# EAGLE design RFPIGW (EAGLE 6.5.0)
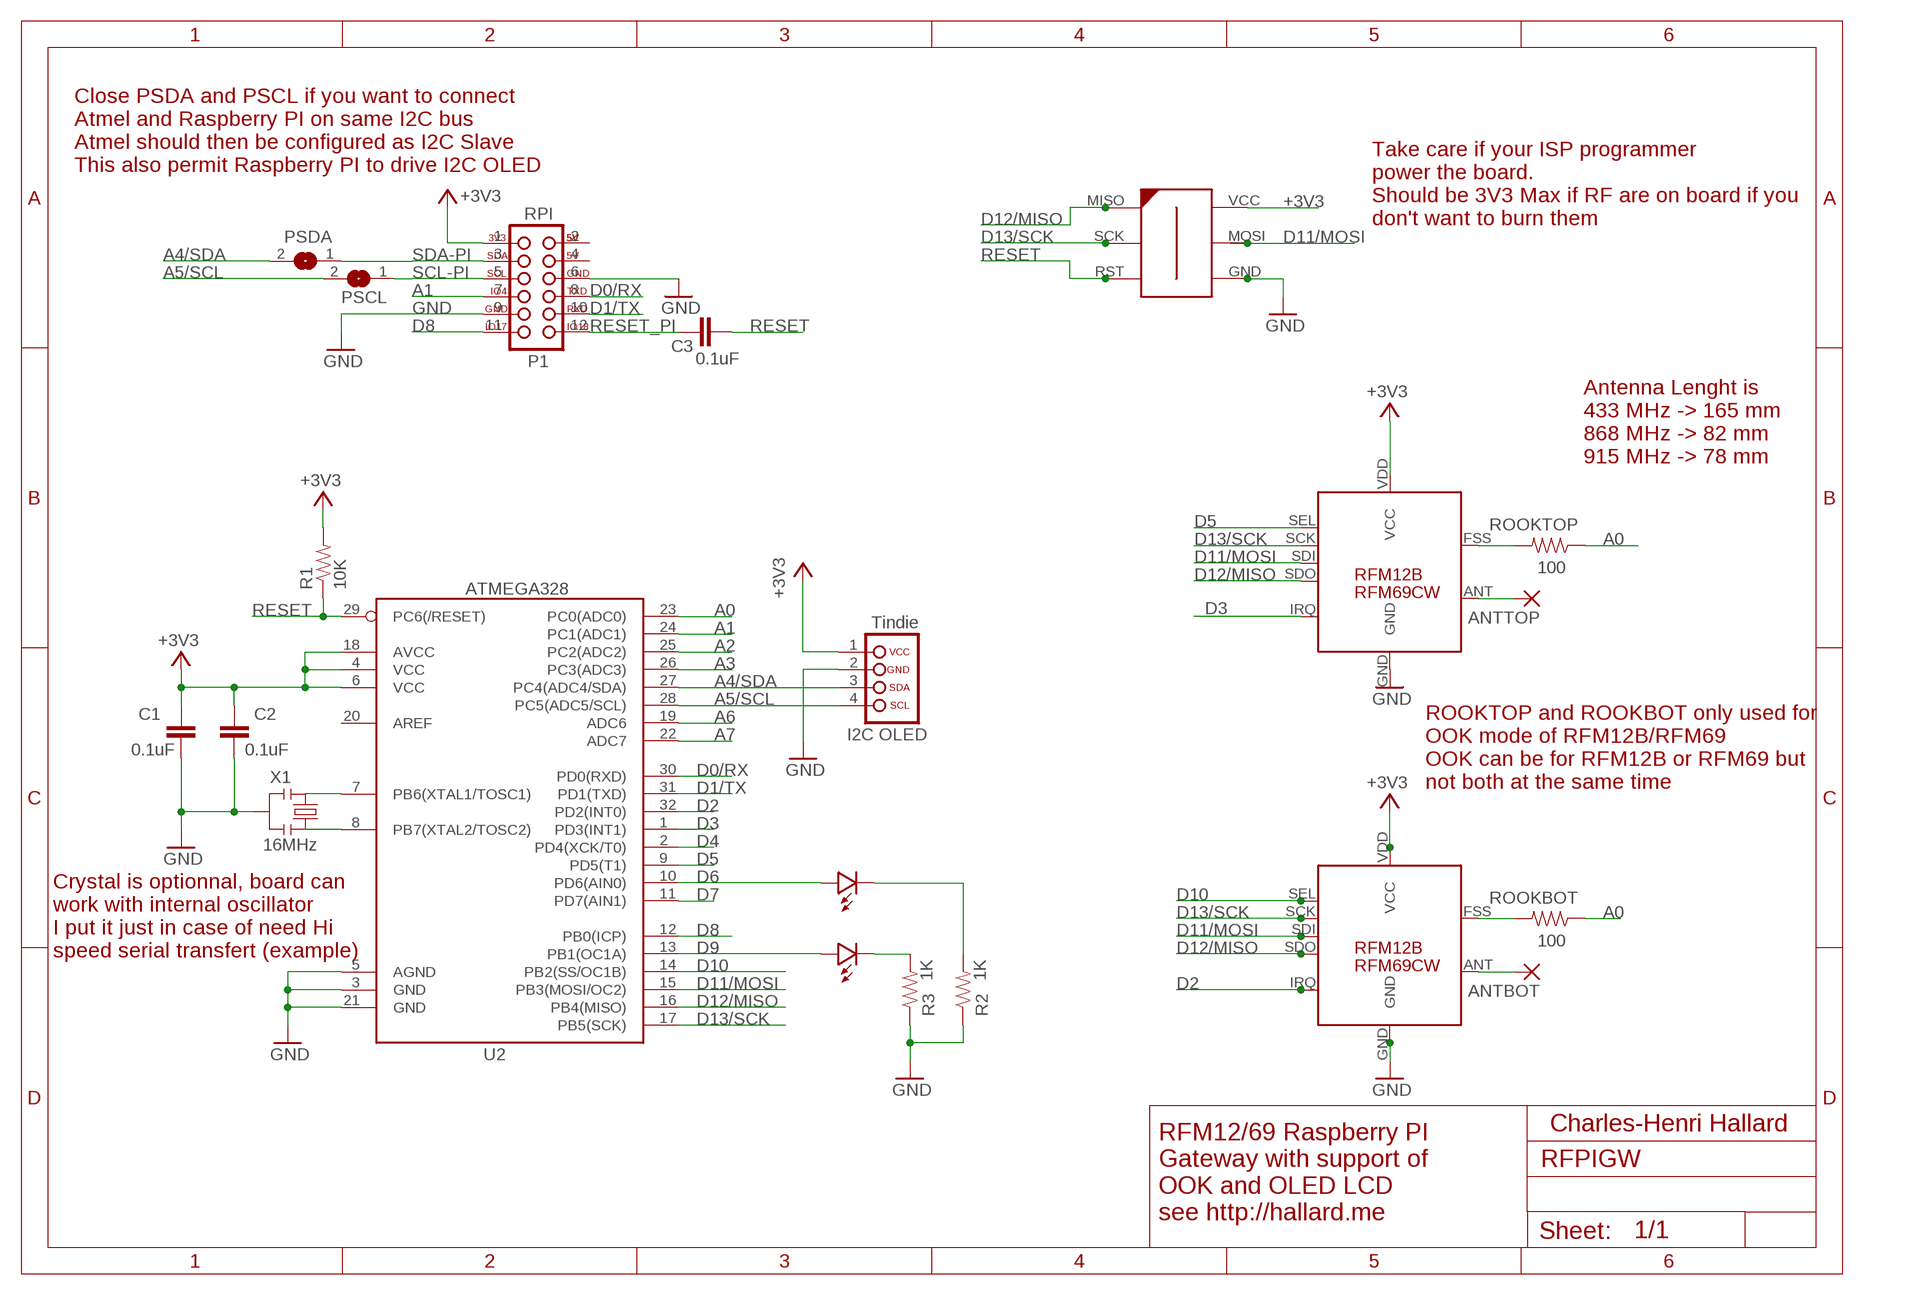
[diagram p0: schematic, sheet 1]

## Parts
ANTBOT  1,6/0,8  [1,6/0,8]
ANTTOP  1,6/0,8  [1,6/0,8]
C1  0.1uF  CAP0805-CAP  [0805-CAP]
C2  0.1uF  CAP0805-CAP  [0805-CAP]
C3  0.1uF  CAP0805-CAP  [0805-CAP]
LED1  LED0805-LARGE  [0805-LED-LARGEPADS]
LED2  LED0805-LARGE  [0805-LED-LARGEPADS]
OLED  OLED_I2C_TINDIE  [1X04_NO_LOCK]
PSCL  SJ  [SJ]
PSDA  SJ  [SJ]
R1  10K  RESISTOR0805-RES  [0805-RES]
R2  1K  RESISTOR0805-RES  [0805-RES]
R3  1K  RESISTOR0805-RES  [0805-RES]
ROOKBOT  100  RESISTOR0805-RES  [0805-RES]
ROOKTOP  100  RESISTOR0805-RES  [0805-RES]
U2  ATMEGA328  ATMEGA168  [TQFP32-08]
U$1  PI P1  RASPBERRY_PI_2X6  [2X06_LOCK]
U$2  RFM12B  [RFM12B-MINPADS]
U$3  RFM12B  [RFM12B-MINPADS]
U$4  AVR-ISP-6-EDGE  [6PAD_ISP]
X1  16MHz  RESONATOR16MHZ  [RESONATOR-SMD]

## Nets
+3V3 [power]: C1.1 C2.1 OLED.1(VCC) R1.2 U2.4(VCC) U2.6(VCC) U2.18(AVCC) U$1.1 U$2.VDD(VCC) U$3.VDD(VCC) U$4.VCC
A0: ROOKBOT.1 ROOKTOP.1 U2.23(PC0(ADC0))
A1: U2.24(PC1(ADC1)) U$1.7
A2: U2.25(PC2(ADC2))
A3: U2.26(PC3(ADC3))
A4/SDA: OLED.3(SDA) PSDA.2 U2.27(PC4(ADC4/SDA))
A5/SCL: OLED.4(SCL) PSCL.2 U2.28(PC5(ADC5/SCL))
A6: U2.19(ADC6)
A7: U2.22(ADC7)
D0/RX: U2.30(PD0(RXD)) U$1.8
D1/TX: U2.31(PD1(TXD)) U$1.10
D2: U2.32(PD2(INT0)) U$2.IRQ
D3: U2.1(PD3(INT1)) U$3.IRQ
D4: U2.2(PD4(XCK/T0))
D5: U2.9(PD5(T1)) U$3.SEL
D6: LED2.PLUS U2.10(PD6(AIN0))
D7: U2.11(PD7(AIN1))
D8: U2.12(PB0(ICP)) U$1.11
D9: LED1.PLUS U2.13(PB1(OC1A))
D10: U2.14(PB2(SS/OC1B)) U$2.SEL
D11/MOSI: U2.15(PB3(MOSI/OC2)) U$2.SDI U$3.SDI U$4.MOSI
D12/MISO: U2.16(PB4(MISO)) U$2.SDO U$3.SDO U$4.MISO
D13/SCK: U2.17(PB5(SCK)) U$2.SCK U$3.SCK U$4.SCK
GND [power]: C1.2 C2.2 OLED.2(GND) R2.1 R3.1 U2.3(GND) U2.5(AGND) U2.21(GND) U$1.6 U$1.9 U$2.GND U$3.GND U$4.GND X1.2
N$1: ROOKBOT.2 U$2.FSS(FFS)
N$2 [power]: ANTTOP.1(P) U$3.ANT
N$3: LED1.MINUS R3.2
N$4: ROOKTOP.2 U$3.FSS(FFS)
N$5: U2.7(PB6(XTAL1/TOSC1)) X1.1
N$6: ANTBOT.1(P) U$2.ANT
N$7: U2.8(PB7(XTAL2/TOSC2)) X1.3
N$8: LED2.MINUS R2.2
RESET: C3.2 R1.1 U2.29(PC6(/RESET)) U$4.RST
RESET_PI: C3.1 U$1.12
SCL-PI: PSCL.1 U$1.5
SDA-PI: PSDA.1 U$1.3
Unconnected: U2.20(AREF)

## Notes on the sheet
- Close PSDA and PSCL if you want to connect 
  Atmel and Raspberry PI on same I2C bus
  Atmel should then be configured as I2C Slave
  This also permit Raspberry PI to drive I2C OLED
- Take care if your ISP programmer
  power the board.
  Should be 3V3 Max if RF are on board if you
  don't want to burn them
- Antenna Lenght is
  433 MHz -> 165 mm
  868 MHz -> 82 mm
  915 MHz -> 78 mm
- RFM69CW
- ROOKTOP and ROOKBOT only used for
  OOK mode of RFM12B/RFM69
  OOK can be for RFM12B or RFM69 but
  not both at the same time
- Crystal is optionnal, board can
  work with internal oscillator
  I put it just in case of need Hi
  speed serial transfert (example)
- RFM69CW
- Charles-Henri Hallard
- RFM12/69 Raspberry PI
  Gateway with support of 
  OOK and OLED LCD
  see http://hallard.me

## Power pins joined to a net without a drawn wire
2: U$1.2
4: U$1.4

## Library data of the parts
ANTBOT ANTTOP = JeeLabs:1,6/0,8: THROUGH-HOLE PAD
C1-C3 = _c2h:CAP: Capacitor Standard 0603 ceramic capacitor, and 0.1" leaded capacitor.
LED1 LED2 = _c2h:LED
OLED = _c2h:OLED_I2C_TINDIE
PSCL PSDA = jumper:SJ: SMD solder JUMPER
R1-R3 ROOKBOT ROOKTOP = _c2h:RESISTOR: Resistor Basic schematic elements and footprints for 0603, 1206, and PTH resistors.
U2 = SparkFun:ATMEGA168
U$1 = _c2h:RASPBERRY_PI_2X6
U$2 U$3 = _c2h:RFM12B
U$4 = avr-7:AVR-ISP-6-EDGE: 6 pin edge connector for ISP with ATMEL MCUs. Developed by Craig Moates (craig at moates dot net). Library by David Blundell (blundar at gmail dot com). Often, even a 6 pin header is really inconvenient for board layout and/or production. This SMD-only header is our de-facto standard for using an edge connector for programming with the help of a 6pin/10pin to edge card adapter.
X1 = SparkFun-FreqCtrl:RESONATOR: Resonator Small SMD resonator. Used, eg, on the Arduino Pro/ Pro Mini boards. 8MHz- XTAL-08895 16MHz- XTAL-08900; PROD_ID: XTAL-08900

## Net classes
0 default: width 0.152 mm, drill 0.356 mm, clearance 0.152 mm
1 power: width 0.203 mm, drill 0.356 mm, clearance 0.152 mm

## Board
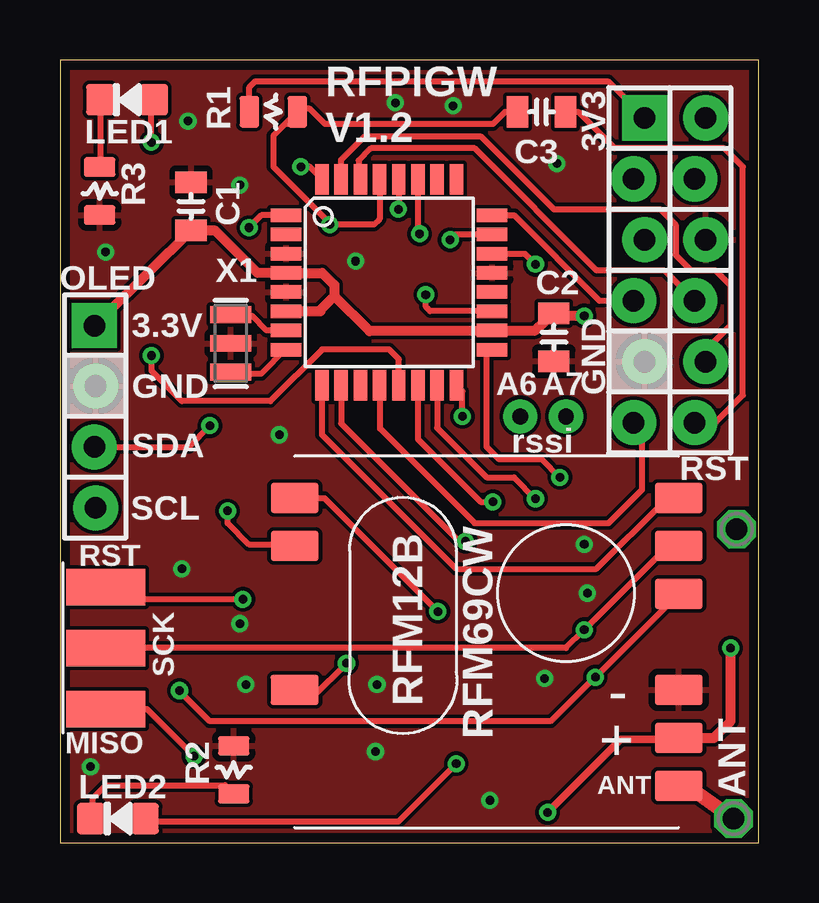
[diagram p1: board, top side]
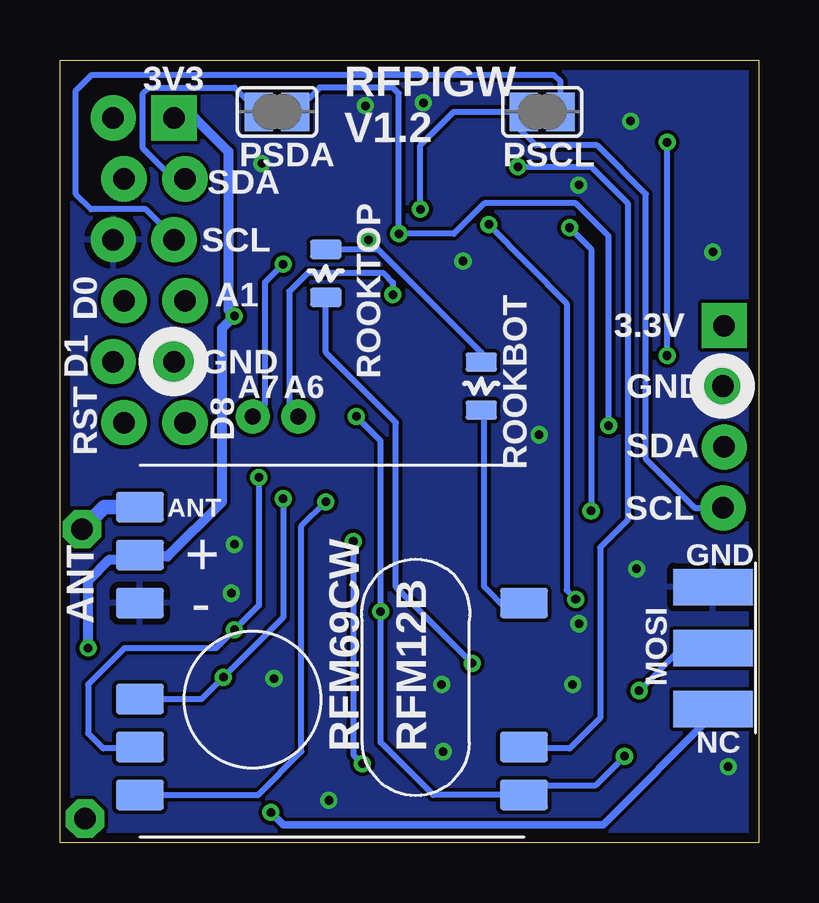
[diagram p2: board, bottom side, seen from below]

Size 29.11 x 32.64 mm. Coordinates in mm from the lower left corner, seen from the top.
Outline: 0,32.64 0,0 29.11,0 29.11,32.64 0,32.64
Copper layers (1*16): Top 0.0356mm / dielectric 1.5011mm / Bottom 0.0356mm
Design rules "LaenPCBOrder *": minimum track width 6mil, minimum drill 13mil, track to track 6mil, track to pad 6mil, pad to pad 6mil, via to via 6mil, smd to smd 6mil, copper to edge 15mil, drill to drill 6mil, minimum pad ring 7mil, minimum via ring 7mil, stop-mask expansion 3mil, vias tented up to drill 40mil, thermal gap 10mil

### Footprints (pad centres in the part's own frame; a part is rotated, then mirrored left to right if it is on the bottom)
1,6/0,8 = drill 0.9 pad 1.6 octagon: 1 0,0
0805-CAP = smd 0.902 x 1.3: 1 -1,0; 2 1,0
0805-LED-LARGEPADS = smd 1.156 x 1.3: MINUS -1.127,0; PLUS 1.127,0
1X04_NO_LOCK = drill 0.9 pad 1.88 square: 1 -3.785,-0.152 | drill 0.9 pad 1.88: 2 -1.27,-0.102; 3 1.27,-0.152; 4 3.81,-0.102
SJ = smd 1.168 x 1.6: 1 -0.762,0; 2 0.762,0
0805-RES = smd 0.8 x 1.3: 1 -1,0; 2 1,0
TQFP32-08 = smd 1.27 x 0.559: 1 -4.293,2.8; 2 -4.293,2; 3 -4.293,1.2; 4 -4.293,0.4; 5 -4.293,-0.4; 6 -4.293,-1.2; 7 -4.293,-2; 8 -4.293,-2.8; 17 4.293,-2.8; 18 4.293,-2; 19 4.293,-1.2; 20 4.293,-0.4; 21 4.293,0.4; 22 4.293,1.2; 23 4.293,2; 24 4.293,2.8 | smd 0.559 x 1.27: 9 -2.8,-4.293; 10 -2,-4.293; 11 -1.2,-4.293; 12 -0.4,-4.293; 13 0.4,-4.293; 14 1.2,-4.293; 15 2,-4.293; 16 2.8,-4.293; 25 2.8,4.293; 26 2,4.293; 27 1.2,4.293; 28 0.4,4.293; 29 -0.4,4.293; 30 -1.2,4.293; 31 -2,4.293; 32 -2.8,4.293
2X06_LOCK = drill 0.9 pad 1.88 square: 1 -6.35,-1.041 | drill 0.9 pad 1.88: 2 -6.35,1.499; 3 -3.81,-1.499; 4 -3.81,1.041; 5 -1.27,-1.041; 6 -1.27,1.499; 7 1.27,-1.499; 8 1.27,1.041; 9 3.81,-1.041; 10 3.81,1.499; 11 6.35,-1.499; 12 6.35,1.041
RFM12B-MINPADS = smd 2 x 1.27: ANT 8,-6; FSS -8.002,-2; GND 8,-2; IRQ -8,4; SCK 8,4; SDI 8,2; SDO -8,6; SEL 8,6; VDD 8,-4
6PAD_ISP = smd 1.524 x 3.302 bottom: GND 2.54,0; MOSI 0,0; VCC -2.54,0 | smd 1.524 x 3.302: MISO -2.54,0; RST 2.54,0; SCK 0,0
RESONATOR-SMD = smd 0.7 x 1.7: 1 -1.2,0; 2 0,0; 3 1.2,0

### Placement (x,y rotation side)
ANTBOT  28.19,13.08 0 top
ANTTOP  28.07,1.02 0 top
C1  5.46,26.54 90 top
C2  20.57,21.08 270 top
C3  20.07,30.48 180 top
LED1  2.79,30.99 0 top
LED2  2.41,1.02 0 top
OLED  1.59,17.78 270 top
PSCL  9.02,30.48 180 bottom
PSDA  20.07,30.48 0 bottom
R1  8.89,30.48 180 top
R2  7.24,3.05 270 top
R3  1.65,27.18 90 top
ROOKBOT  11.56,19.05 270 bottom
ROOKTOP  18.03,23.75 270 bottom
U2  13.72,23.37 0 top
U$1  25.4,23.88 270 top
U$2  17.78,8 180 bottom
U$3  17.78,8.38 0 top
U$4  1.91,8.13 90 top
X1  7.11,20.83 270 top

### Tracks (layer width: path | path; a pad name or v marks a point on that pad's centre or on a via)
+3V3  (via drill 0.36 pad 0.69, 0.36 pad 0.71)
  Top 0.254: R1.2 7.89,31.51 8.13,31.75 22.84,31.75 U$1.1
  Top 0.305: v20.32,1.27 23.37,4.32 25.72,4.32 U$3.VDD
  Top 0.406: U2.6 10.85,22.17 10.85,22.23 11.43,22.8 | U$3.VDD 27.24,4.38 27.94,5.08 v27.94,8.13 | v21.84,21.97 20.61,21.97 C2.1 19.8,21.37 U2.18 17.98,21.34 12.9,21.34 11.43,22.8 | 11.43,22.8 11.43,23.26 10.92,23.77 U2.4 8.24,23.77 6.48,25.53 5.53,25.53 C1.1 1.88,22.01 OLED.1
  Bottom 0.254: U$2.VDD 25.72,12.38 25.91,11.94
  Bottom 0.305: U$4.VCC 1.91,5.33 6.48,0.76 19.81,0.76 v20.32,1.27
  Bottom 0.406: U$1.1 23.5,30.23 22.1,28.83 22.1,22.23 v21.84,21.97 22.35,21.46 22.35,14.22 24.64,11.94 25.72,11.94 U$2.VDD 25.97,11.81 27.05,11.81 27.94,10.92 v27.94,8.13
A0  (via drill 0.36)
  Top 0.254: U2.23 16.48,25.37 v16.26,25.15
  Bottom 0.254: ROOKTOP.1 15.86,24.75 v16.26,25.15 11.56,20.45 ROOKBOT.1
A1
  Top 0.254: U2.24 18.92,26.17 22.48,22.61 U$1.7
A4/SDA  (via drill 0.36, 0.36 pad 0.69)
  Top 0.254: U2.27 14.92,25.47 v14.99,25.4 | OLED.3 5.36,16.51 v6.25,17.4
  Bottom 0.254: 19.43,29.84 19.43,30.35 PSDA.2 | v14.99,25.4 14.99,31.24 15.24,31.5 18.29,31.5 PSDA.2 | 19.05,30.23 PSDA.2 | v14.99,25.4 14.86,25.4 | v6.25,17.4 6.25,25.3 7.62,26.67 11.43,26.67 12.7,25.4 v14.99,25.4
A5/SCL  (via drill 0.36)
  Top 0.254: U2.28 14.12,26.43 v14.1,26.42
  Bottom 0.254: OLED.4 2.67,13.97 4.7,16 4.7,27.05 6.73,29.08 9.27,29.08 10.03,29.84 10.03,30.23 PSCL.2 12.7,30.48 14.1,29.08 v14.1,26.42
A6  (via drill 0.36 pad 0.69, 0.66 pad 1.42)
  Top 0.254: U2.19 15.42,22.17 15.24,22.35 v15.24,22.86
  Bottom 0.254: v15.24,22.86 15.24,23.37 15.62,23.75 18.8,23.75 19.56,22.99 19.56,18.16 v19.18,17.78
A7  (via drill 0.36 pad 0.69, 0.66 pad 1.42)
  Top 0.254: U2.22 19.37,24.57 v19.81,24.13
  Bottom 0.254: v19.81,24.13 20.57,23.37 20.57,18.29 v21.08,17.78
D0/RX
  Top 0.254: U2.30 12.45,27.73 12.45,28.45 12.95,28.96 17.27,28.96 22.35,23.88 25.17,23.88 U$1.8
D1/TX
  Top 0.254: U2.31 11.72,28.48 12.7,29.46 17.53,29.46 20.57,26.42 25.02,26.42 25.65,25.78 25.65,24.51 26.29,23.88 27.3,23.88 27.94,23.24 27.94,21.59 26.9,20.55 U$1.10
D2  (via drill 0.36)
  Top 0.254: U2.32 10.92,27.69 10.41,28.19 v10.03,28.19
  Bottom 0.254: v10.03,28.19 6.99,28.19 5.46,26.67 5.46,13.46 6.6,12.32 6.6,5.21 7.87,3.94 9.72,3.94 U$2.IRQ
D3  (via drill 0.36)
  Top 0.254: U2.1 8.39,26.17 v7.87,25.65 | U$3.IRQ 9.97,12.45 7.87,12.45 6.99,13.34 v6.99,13.84
  Bottom 0.254: v7.87,25.65 6.99,24.77 v6.99,13.84
D5
  Top 0.254: U$3.SEL 25.62,14.22 25.15,14.22 22.35,11.43 16.51,11.43 10.92,17.02 U2.9
D6  (via drill 0.36)
  Top 0.254: U2.10 11.72,17.49 16.64,12.57 v16.89,12.57 | v16.51,3.3 14.1,0.89 3.79,0.89 LED2.PLUS
  Bottom 0.254: v16.89,12.57 16.89,3.68 v16.51,3.3
D8
  Top 0.254: U2.12 13.34,19.06 13.34,17.27 17.27,13.34 22.86,13.34 24.26,14.73 24.26,17.17 U$1.11
D9  (via drill 0.36 pad 0.69)
  Top 0.254: U2.13 14.12,20.17 13.72,20.57 10.92,20.57 8.76,18.41 5.08,18.41 3.81,19.68 v3.81,20.32 | v3.81,29.21 3.81,30.95 3.79,30.95 LED1.PLUS
  Bottom 0.254: v3.81,20.32 v3.81,29.21
D10  (via drill 0.36)
  Top 0.254: U2.14 14.92,16.83 17.53,14.22 v18.03,14.22
  Bottom 0.254: U$2.SEL 20.86,2 19.05,3.81 19.05,13.21 v18.03,14.22
D11/MOSI  (via drill 0.36, 0.36 pad 0.69)
  Top 0.254: 24.99,10.41 U$3.SDI v22.3,6.91 | U2.15 15.72,17.3 17.78,15.24 18.92,15.24 v19.81,14.35 | 22.26,6.99 v22.3,6.91 | v22.3,6.91 22.27,6.91 20.45,5.08 6.25,5.08 v4.98,6.35
  Bottom 0.254: v19.81,14.35 19.81,9.4 v22.3,6.91 23.21,6 U$2.SDI | U$4.MOSI 3.2,8.13 v4.98,6.35
D12/MISO  (via drill 0.36, 0.36 pad 0.69)
  Top 0.254: U2.16 | 16.54,19.05 U2.16 | U$3.SDO 11.02,14.38 v15.75,9.65 | v16.76,17.78 16.76,18.83 U2.16 | U$4.MISO 3.62,5.59 v5.59,3.62
  Bottom 0.254: v16.76,17.78 15.75,16.76 v15.75,9.65 15.75,4.19 13.56,2 U$2.SDO 9.75,2.41 6.79,2.41 v5.59,3.62
D13/SCK  (via drill 0.36)
  Top 0.254: U$4.SCK 21.08,8.13 v21.84,8.89 25.34,12.38 U$3.SCK | 18.17,20.57 U2.17 17.78,20.34 17.78,16.51 18.29,16 20.07,16 v20.83,15.24
  Bottom 0.254: U$2.SCK 25.72,3.94 27.3,3.94 27.94,4.57 27.94,6.6 26.42,8.13 22.61,8.13 v21.84,8.89 20.83,9.91 v20.83,15.24
GND  (via drill 0.36, 0.36 pad 0.41)
  other vias: 20.7,28.32 5.33,30.1 21.97,10.41 16.38,30.73 13.97,30.86 13.14,3.81 17.91,1.78 13.21,6.6 12.32,24.26 9.14,17.02 20.19,6.86 21.84,12.45 7.49,27.43 1.91,24.64 5.08,11.43 7.75,6.6 7.49,9.14 1.27,3.17
  pour Bottom: -1.27,32.77 29.21,32.89 29.21,-0.25 -1.27,-0.25
  pour Top: -1.27,-0.25 29.21,-0.25 29.21,32.89 -1.27,32.77
N$1
  Bottom 0.254: 10.16,10.16 9.94,10.38 U$2.FSS 10.51,9.75 11.43,10.67 11.43,17.92 ROOKBOT.2
N$2
  Top 0.406: 25.88,2.54 U$3.ANT
  Top 0.61: ANTTOP.1 25.88,2.54
N$3
  Top 0.254: R3.2 1.67,28.5 | 1.62,28.47 R3.2 | LED1.MINUS 1.67,28.5 | 1.67,28.5 1.67,28.16 R3.2
N$4  (via drill 0.36)
  Top 0.254: U$3.FSS 9.87,6.73 10.54,6.1 v11.94,7.49
  Bottom 0.254: 17.78,22.5 ROOKTOP.2 18.03,20.45 15.11,17.53 15.11,10.67 v11.94,7.49
N$5
  Top 0.254: U2.7 8.6,21.37 8,21.97 7.17,21.97 X1.1
N$6
  Bottom 0.61: U$2.ANT 27.27,14 ANTBOT.1
N$7
  Top 0.254: U2.8 9.39,20.57 8.38,19.56 7.18,19.56 X1.3
N$8
  Top 0.254: 7.1,1.91 R2.2 6.87,2.41 1.91,2.41 1.36,1.87 1.36,0.89 LED2.MINUS
RESET  (via drill 0.36 pad 0.69)
  Top 0.254: U2.29 13.32,26.02 13.08,25.78 v11.24,25.78 11.24,25.84 8.89,28.19 8.89,29.48 R1.1 | R1.1 9.89,29.96 9.38,29.96 | R1.1 10.02,30.61 10.41,30.61 11.05,29.97 18.03,29.97 18.54,30.48 C3.2 | U$4.RST 2.41,10.16 v7.62,10.16
  Bottom 0.254: v11.24,25.78 8,22.48 8,10.54 v7.62,10.16
RESET_PI
  Top 0.254: C3.1 21.59,30.48 23.11,28.96 27.69,28.96 28.45,28.19 28.45,18.67 27.3,17.53 U$1.12
SCL-PI
  Bottom 0.254: PSCL.1 8.26,31.75 8.51,32 27.81,32 28.45,31.37 28.45,27.05 27.81,26.42 25.53,26.42 24.26,25.15 U$1.5
SDA-PI
  Bottom 0.254: PSDA.1 21.84,31.5 25.4,31.5 25.65,31.24 25.65,28.96 24.38,27.69 U$1.3

### Text on the board
tNames: RFPIGW / V1.2 | 3V3 | 3.3V | GND | A6 | A7 | GND | SDA | rssi | RST | SCL | RFM69CW | RST | SCK | MISO | ANT
bNames: 3V3 | RFPIGW / V1.2 | SDA | SCL | D0 | A1 | 3.3V | D1 | GND | GND | A6 | A7 | RST | D8 | SDA | SCL | GND | ANT | MOSI | NC | RFM69CW